# Altium project Hydra A1 UCLO 35131D.PrjPCB (part 1 of 14)
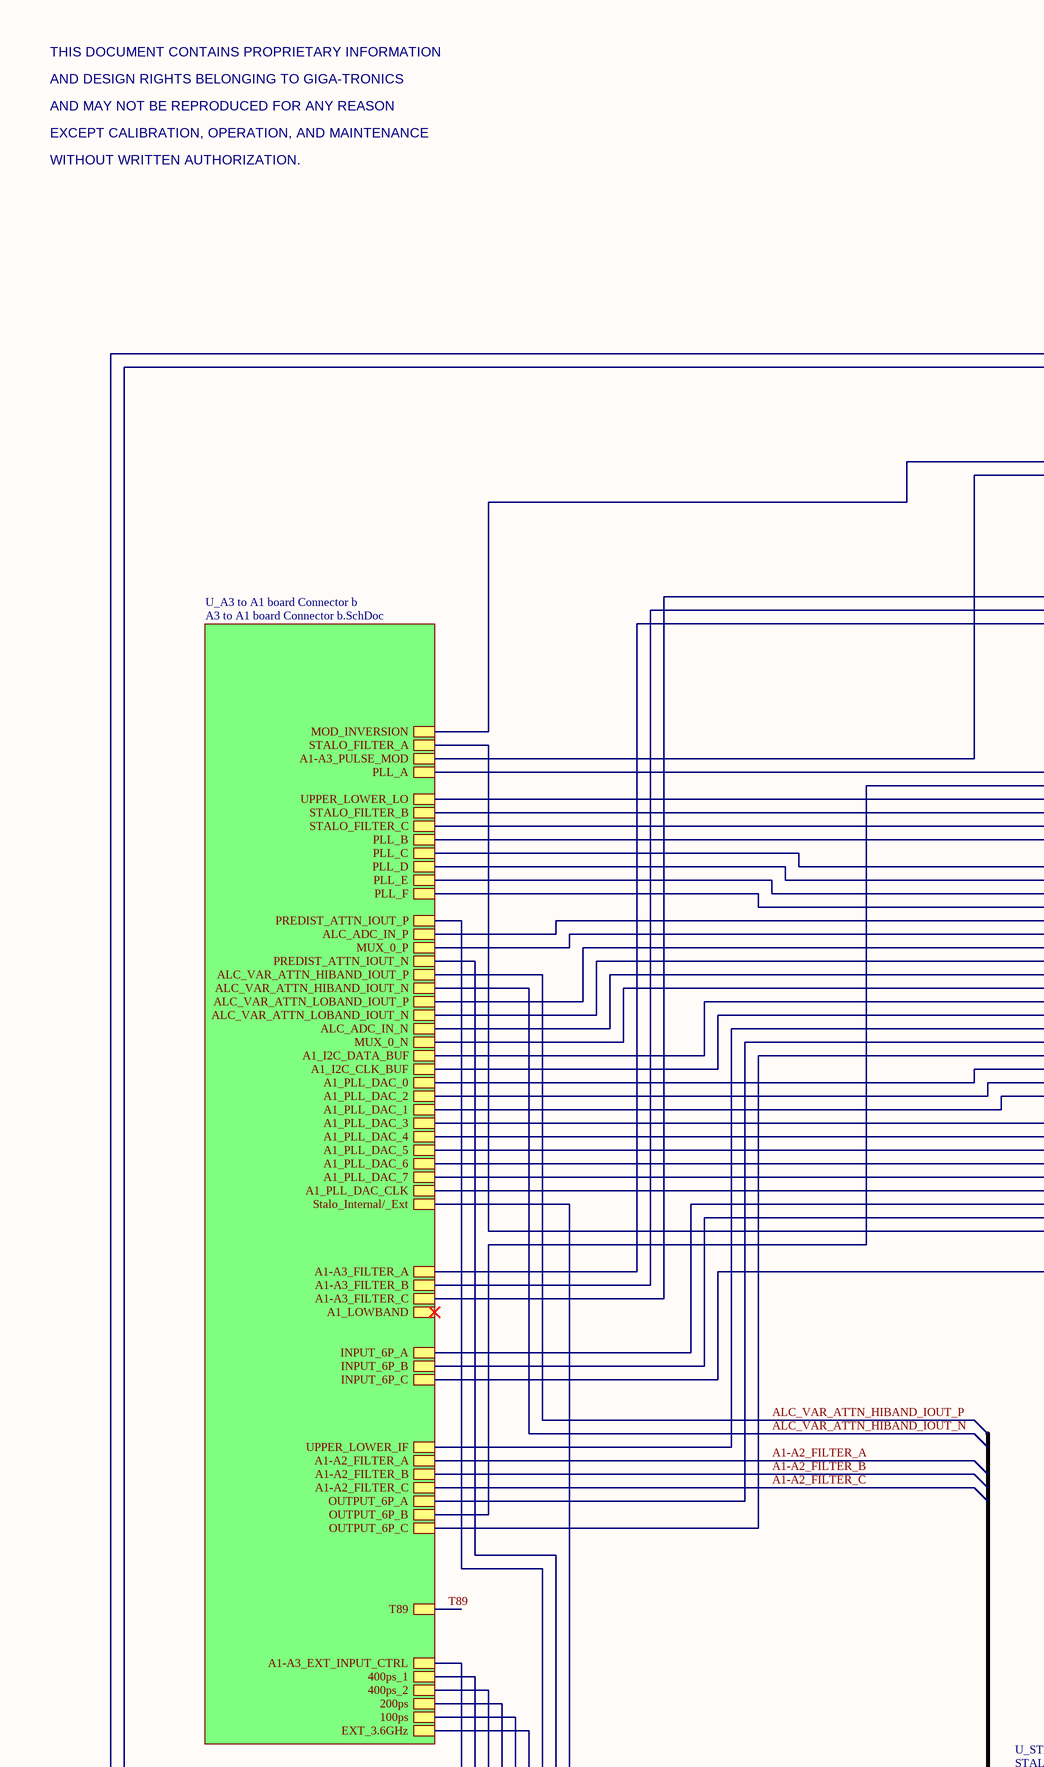
[diagram p0: Sheet1_35131-35133.SchDoc, top left]
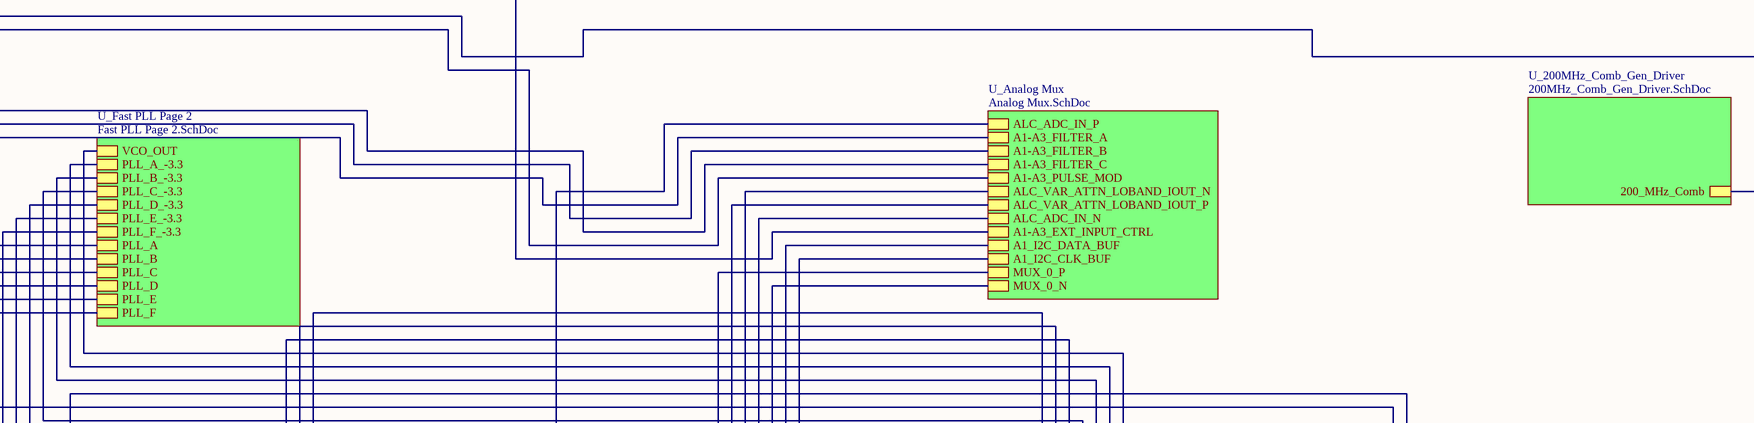
[diagram p1: Sheet1_35131-35133.SchDoc, top middle]
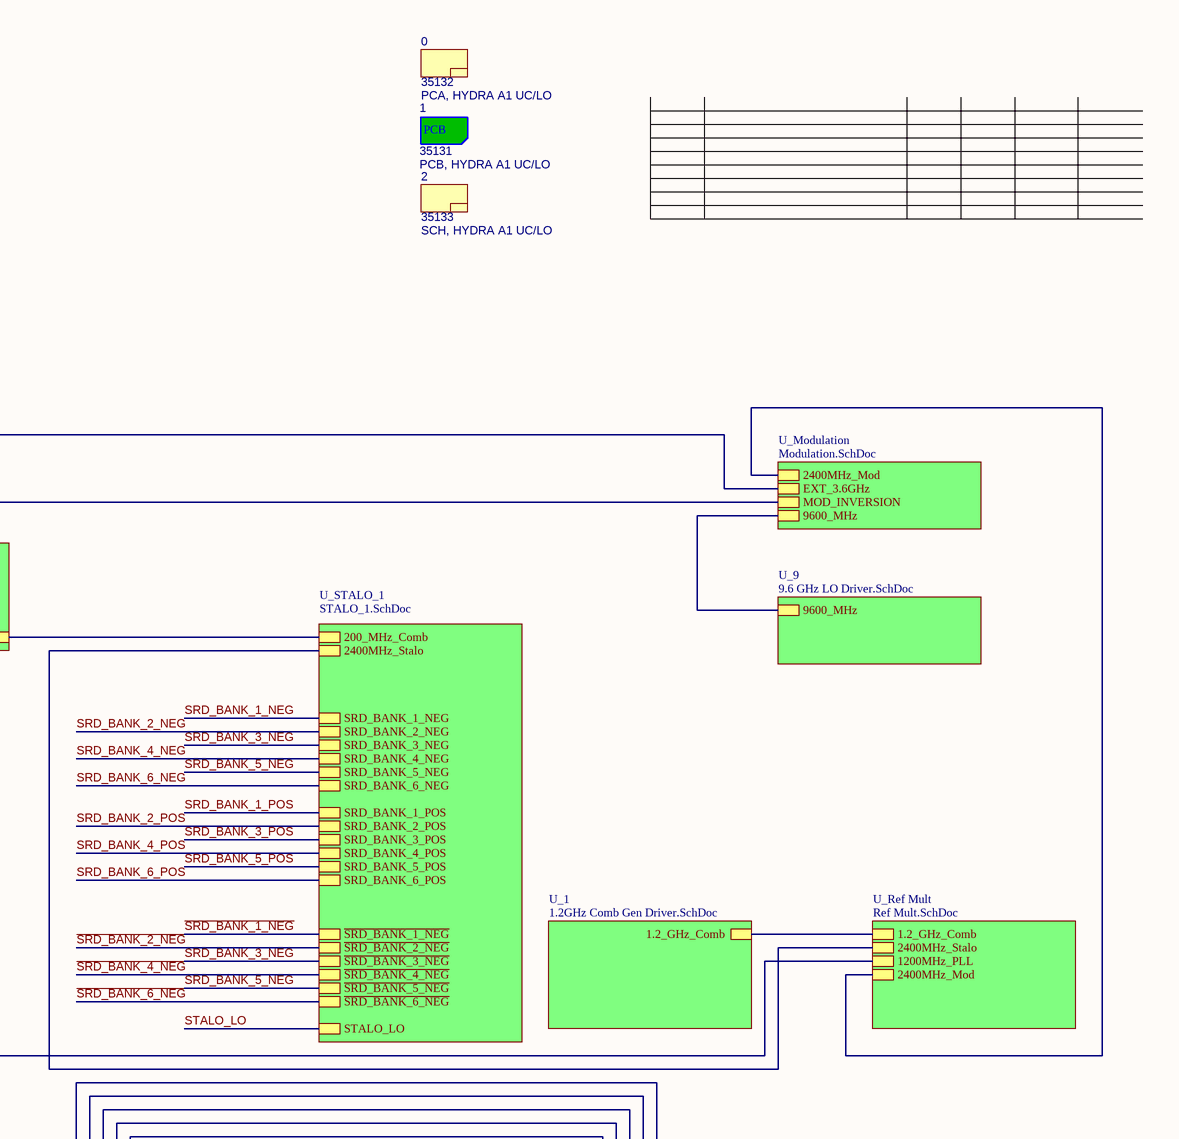
[diagram p2: Sheet1_35131-35133.SchDoc, top right]
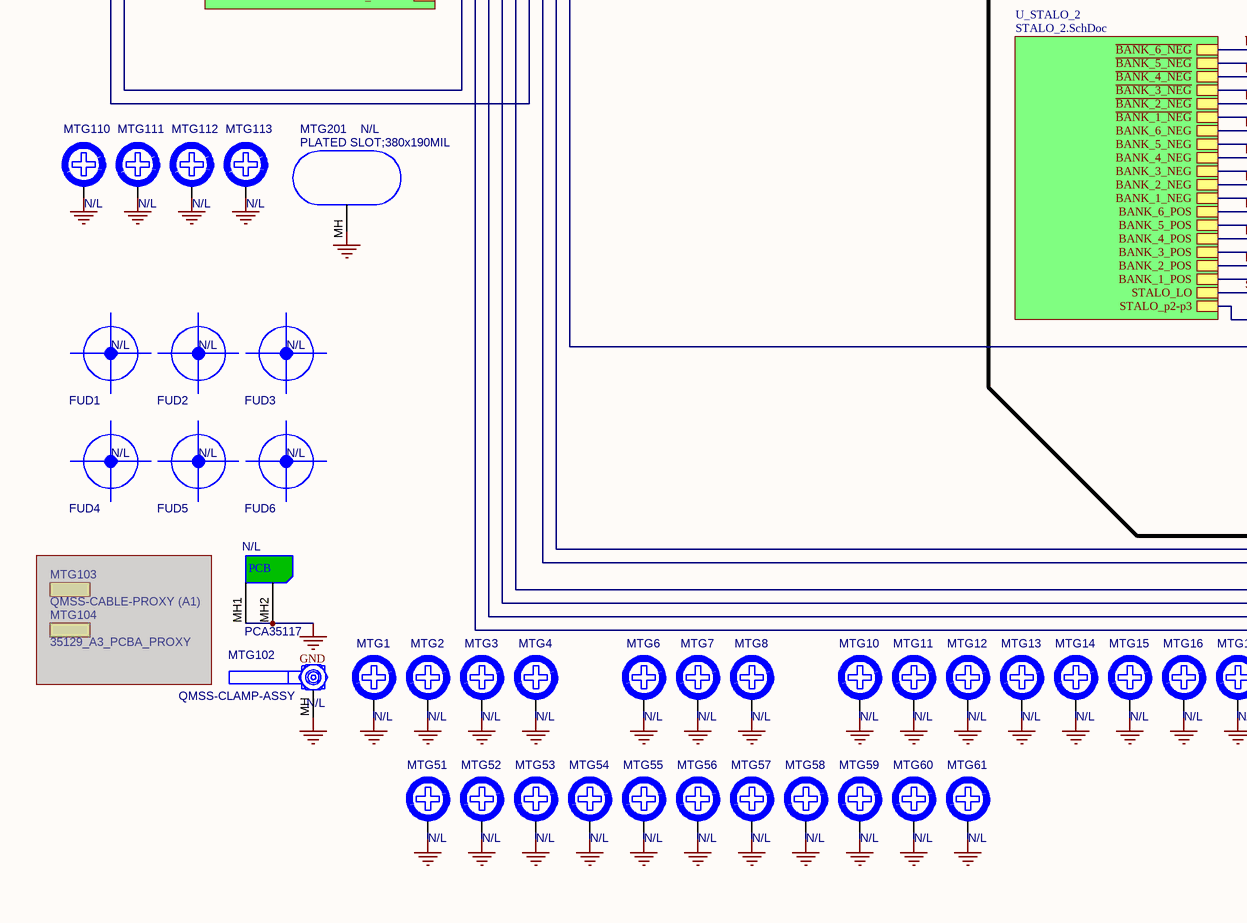
[diagram p3: Sheet1_35131-35133.SchDoc, bottom left]
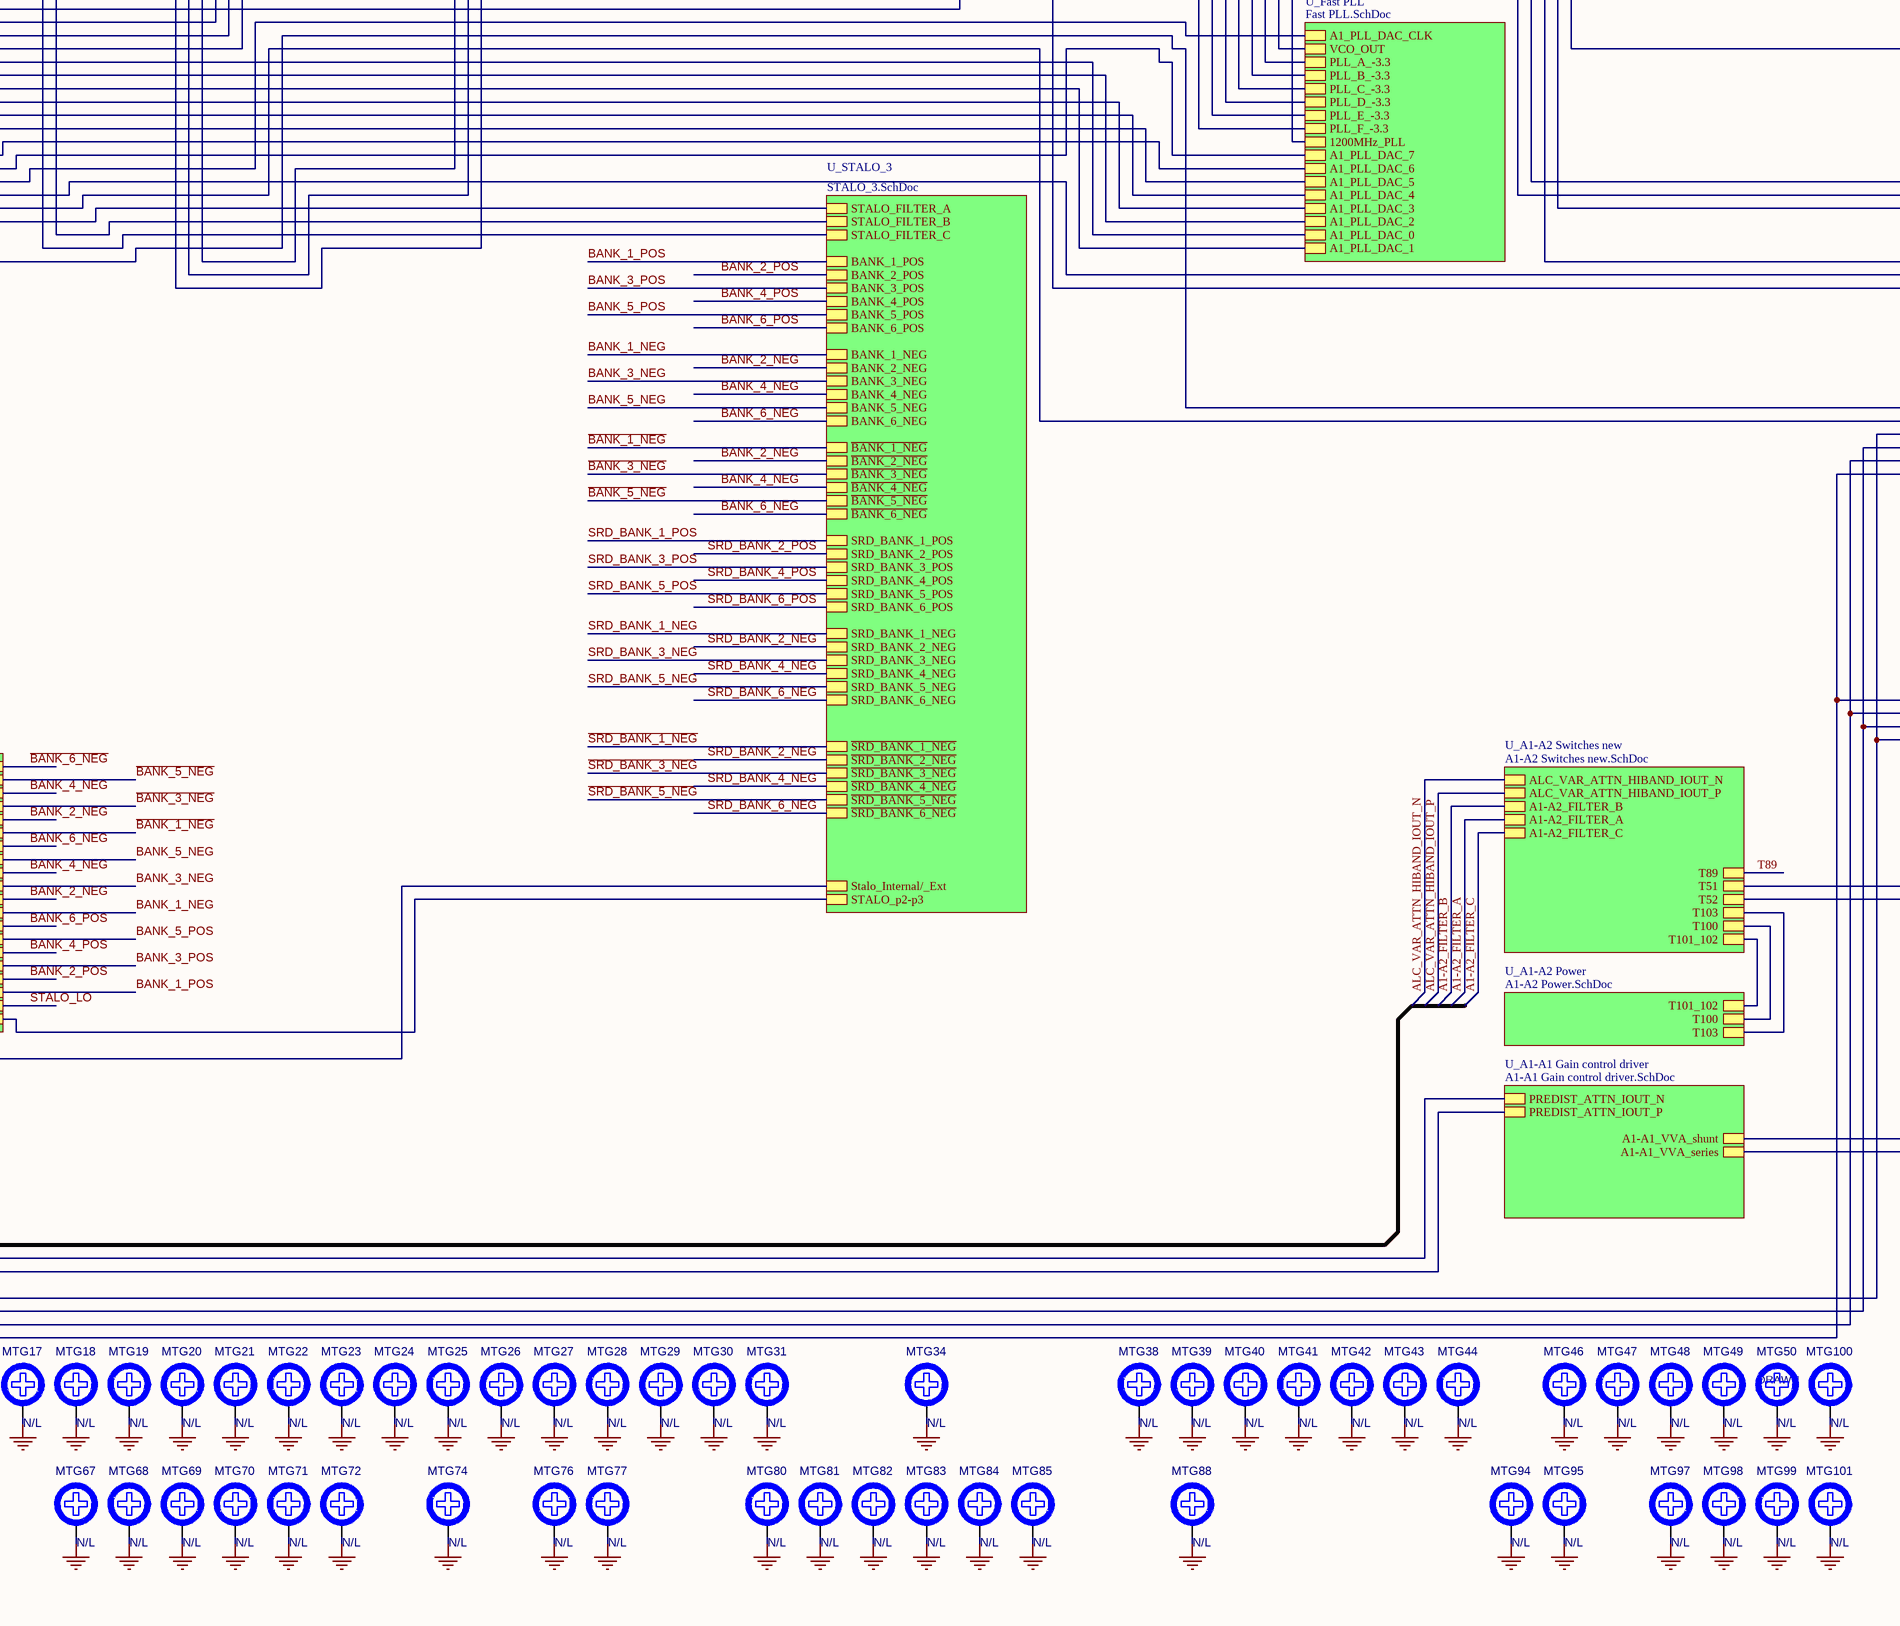
[diagram p4: Sheet1_35131-35133.SchDoc, bottom middle]
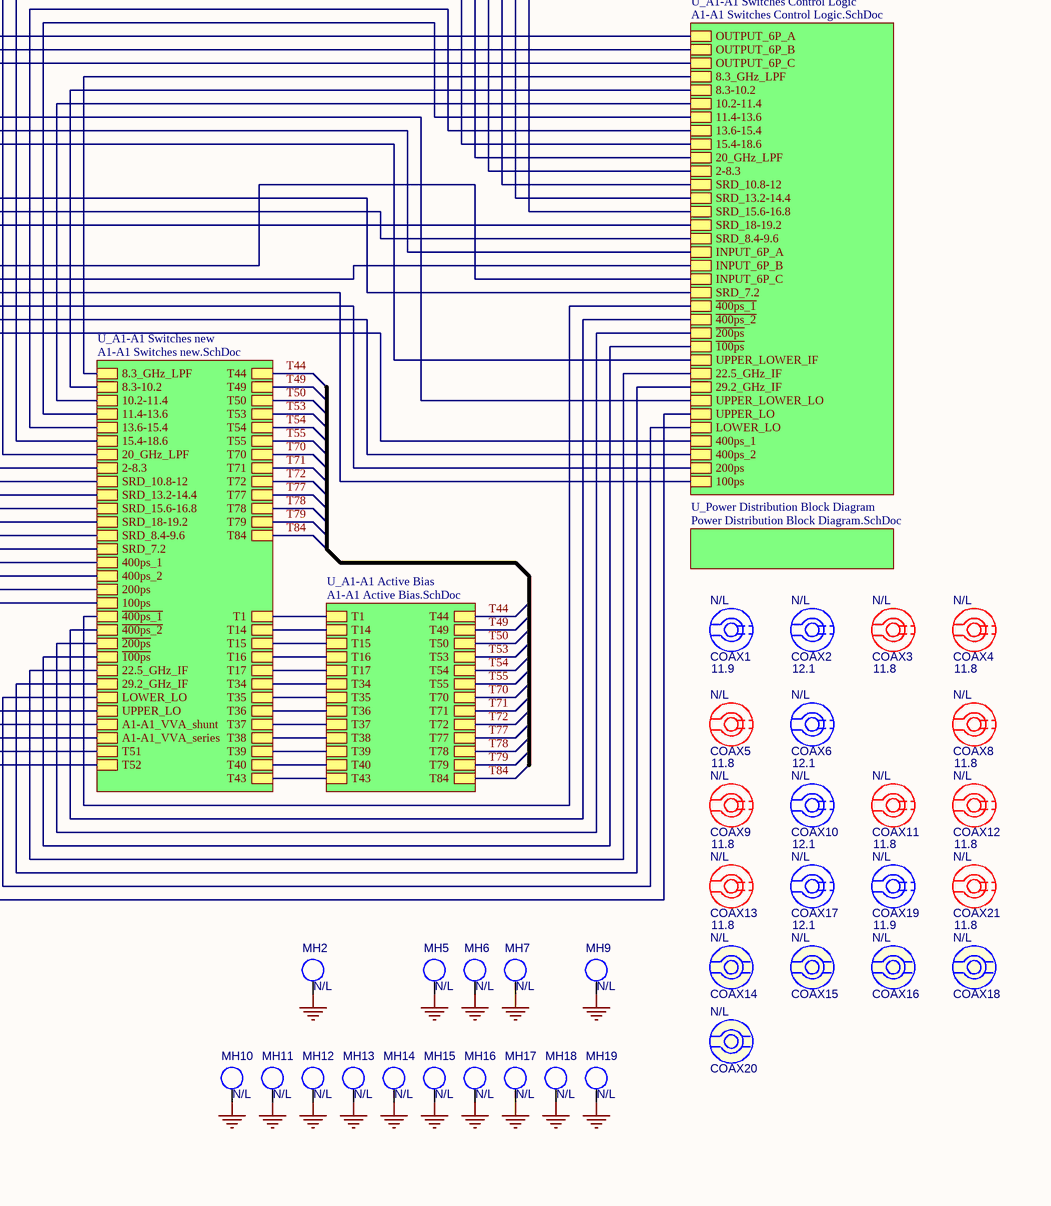
[diagram p5: Sheet1_35131-35133.SchDoc, bottom right]
1PCA_DRW: NM; 1SCH_APPD: CL; 1SCH_DATE: 01-25-13; 1SCH_DESC: INITIAL RELEASE; 1SCH_DRW: CL; 1SCH_ECO: 011078; 1SCH_REV: A; 2PCA_DRW: TM; 2SCH_APPD: CL; 2SCH_DATE: 09-13-13; 2SCH_DESC: COMPLETE RE-DESIGN; 2SCH_DRW: CL; 2SCH_ECO: 011391; 2SCH_REV: B; 3PCA_DRW: CL; 3SCH_APPD: CL; 3SCH_DATE: 09-20-14; 3SCH_DESC: PARTIAL RE-DESIGN; 3SCH_DRW: CL; 3SCH_ECO: 011701; 3SCH_REV: B1; 4PCA_DRW: CL; 4SCH_APPD: CL; 4SCH_DATE: 12-12-14; 4SCH_DESC: SEVERAL MODIFICATIONS; 4SCH_DRW: CL; 4SCH_ECO: 011759; 4SCH_REV: C; 5PCA_DRW: CL; 5SCH_APPD: CL; 5SCH_DATE: 12-19-14; 5SCH_DESC: SEVERAL MODIFICATIONS; 5SCH_DRW: CL; 5SCH_ECO: 011771; 5SCH_REV: D; 6PCA_DRW: MH; 6SCH_APPD: CL; 6SCH_DATE: 06-25-15; 6SCH_DESC: REWORK #2 A1-A6 HOLE TO #4; 6SCH_DRW: MH; 6SCH_ECO: 011876; 6SCH_REV: E; 7PCA_DRW: MH; 7SCH_APPD: CL; 7SCH_DATE: 08-20-15; 7SCH_DESC: CHANGES TO MEET ELEC. SPEC.; 7SCH_DRW: CL; 7SCH_ECO: 011955; 7SCH_REV: F; 8PCA_DRW: MH; 8SCH_APPD: CL; 8SCH_DATE: 01-26-16; 8SCH_DESC: HYDRA A1: 35131F, 35312J; 8SCH_DRW: CL; 8SCH_ECO: 012042; 8SCH_REV: J; 9PCA_DRW: MH; 9SCH_APPD: CL; 9SCH_DATE: 03-31-16; 9SCH_DESC: STALO MODS; 9SCH_DRW: CL; 9SCH_ECO: 012261; 9SCH_REV: K; 10PCA_DRW: MH; 10SCH_APPD: CL; 10SCH_DATE: 11-16-16; 10SCH_DESC: A11 BIAS CHANGE; 10SCH_DRW: MH; 10SCH_ECO: 012390; 10SCH_REV: L; 11PCA_DRW: MH; 11SCH_APPD: CL; 11SCH_DATE: 12-14-16; 11SCH_DESC: CHANGE AT16 TO 3DB; 11SCH_DRW: CL; 11SCH_ECO: 012405; 11SCH_REV: M; 12PCA_DRW: MH; 12SCH_APPD: CL; 12SCH_DATE: 12-16-16; 12SCH_DESC: A1 PERM CHANGE; 12SCH_DRW: CL; 12SCH_ECO: 012269; 12SCH_REV: N; ASSEMBLY_TITLE: CCA, HYDRA A1 UCLO; CAGE_CODE: 58900; CONTRACT_NUMBER: -; PCA_DWG_NO: T-35132; PCA_ED: 1; PCA_REV: N; PCA_TITLE: PCA, HYDRA A1 UC/LO; PCB_2_DEC_TOL: +/-.03; PCB_3_DEC_TOL: +/-.010; PCB_ANG_TOL: +/-1/2; PCB_DWG_NO: T-35131; PCB_ED: 1; PCB_PART_NUMBER: T-35131; PCB_REV: G; PCB_SCALE: NOT TO SCALE; PCB_TITLE: PCB, HYDRA A1 UC/LO; ProjectRevision: E; SCH_DATE: 01-26-16; SCH_DWG_NO: T-35133; SCH_ED: 1; SCH_REV: N; SCH_TITLE: SCH, HYDRA A1 UC/LO
20 sheets, 2898 parts. Net scope: hierarchical (ports join the sheet entries above them; power ports are global).
Board file: Hydra A1 UCLO 35131D.PcbDoc
Sheets:
  Sheet1_35131-35133.SchDoc
    U_A1-A2 Switches new = A1-A2 Switches new.SchDoc
    U_1 = 1.2GHz Comb Gen Driver.SchDoc
    U_A1-A1 Active Bias = A1-A1 Active Bias.SchDoc
    U_A1-A1 Gain control driver = A1-A1 Gain control driver.SchDoc
    U_Fast PLL Page 2 = Fast PLL Page 2.SchDoc
    U_Fast PLL = Fast PLL.SchDoc
    U_A1-A1 Switches Control Logic = A1-A1 Switches Control Logic.SchDoc
    U_Analog Mux = Analog Mux.SchDoc
    U_A1-A1 Switches new = A1-A1 Switches new.SchDoc
    U_200MHz_Comb_Gen_Driver = 200MHz_Comb_Gen_Driver.SchDoc
    U_Power Distribution Block Diagram = Power Distribution Block Diagram.SchDoc
    U_A1-A2 Power = A1-A2 Power.SchDoc
    U_Ref Mult = Ref Mult.SchDoc
    U_A3 to A1 board Connector b = A3 to A1 board Connector b.SchDoc
    U_STALO_2 = STALO_2.SchDoc
    U_STALO_1 = STALO_1.SchDoc
    U_STALO_3 = STALO_3.SchDoc
    U_9 = 9.6 GHz LO Driver.SchDoc
    U_Modulation = Modulation.SchDoc

## Sheet Sheet1_35131-35133.SchDoc: Sheet1_35131-35133
size D; Date: 3/18/2014; CheckedBy: M. HOOPES; DrawnBy: C. LEWIS; Engineer: C. LEWIS; Address1: 4650 NORRIS CANYON RD.; Address2: SAN RAMON, CA 94583; DocumentNumber: 35133; Revision: D; SheetNumber: 1; SheetTotal: 20; PageSetup: Record=PageOptions|CenterHorizontal=True|CenterVertical=True|PrintScale=0.68|XCorrection=1.00|YCorrection=1.00|PrintKind=1|BorderSize=5000000|LeftOffset=0|BottomOffset=0|Orientation=2|PaperLength=1000|PaperWidth=1000|Scale=100|PaperSource=15|PrintQuality=600|MediaType=1|DitherType=10|PaperKind=11x17|PrintScaleMode=1; MfgEng: S. GARCIA; QA: G. GARRETTSON; DocumentName: Sheet1.SCHDOC; ModifiedDate: 2-12-13

### Parts
(Parts that share a designator on the sheet are numbered #1, #2 ... from top to bottom, then left to right.)
0  value PCA, HYDRA A1 UC/LO  (hidden comment: 35132)  (mechanical)
1  value PCB, HYDRA A1 UC/LO  (hidden comment: 35131)  (mechanical)
2  value SCH, HYDRA A1 UC/LO  (hidden comment: 35133)  (mechanical)
COAX1  NoLoad: N/L  [Coax_Bot-Mid4]  (hidden comment: Coax Bot-Mid4)
COAX2  NoLoad: N/L  [Coax_Bot-Mid4]  (hidden comment: Coax Bot-Mid4)
COAX3  NoLoad: N/L  [Coax_Top-Mid3]  (hidden comment: Coax Top-Mid3)
COAX4  NoLoad: N/L  [Coax_Top-Mid3]  (hidden comment: Coax Top-Mid3)
COAX5  NoLoad: N/L  [Coax_Top-Mid3]  (hidden comment: Coax Top-Mid3)
COAX6  NoLoad: N/L  [Coax_Bot-Mid4]  (hidden comment: Coax Bot-Mid4)
COAX8  NoLoad: N/L  [Coax_Top-Mid3]  (hidden comment: Coax Top-Mid3)
COAX9  NoLoad: N/L  [Coax_Top-Mid3]  (hidden comment: Coax Top-Mid3)
COAX10  NoLoad: N/L  [Coax_Bot-Mid4]  (hidden comment: Coax Bot-Mid4)
COAX11  NoLoad: N/L  [Coax_Top-Mid3]  (hidden comment: Coax Top-Mid3)
COAX12  NoLoad: N/L  [Coax_Top-Mid3]  (hidden comment: Coax Top-Mid3)
COAX13  NoLoad: N/L  [Coax_Top-Mid3]  (hidden comment: Coax Top-Mid3)
COAX14  NoLoad: N/L  [Coax_Top-Bot]  (hidden comment: Coax Top-Bot)
COAX15  NoLoad: N/L  [Coax_Top-Bot]  (hidden comment: Coax Top-Bot)
COAX16  NoLoad: N/L  [Coax_Top-Bot]  (hidden comment: Coax Top-Bot)
COAX17  NoLoad: N/L  [Coax_Bot-Mid4]  (hidden comment: Coax Bot-Mid4)
COAX18  NoLoad: N/L  [Coax_Top-Bot]  (hidden comment: Coax Top-Bot)
COAX19  NoLoad: N/L  [Coax_Bot-Mid4]  (hidden comment: Coax Bot-Mid4)
COAX20  NoLoad: N/L  [Coax_Top-Bot]  (hidden comment: Coax Top-Bot)
COAX21  NoLoad: N/L  [Coax_Top-Mid3]  (hidden comment: Coax Top-Mid3)
FUD1  NoLoad: N/L  [FIDUCIAL_GLOBAL]  (hidden comment: FIDUCIAL_GLOBAL)
FUD2  NoLoad: N/L  [FIDUCIAL_GLOBAL]  (hidden comment: FIDUCIAL_GLOBAL)
FUD3  NoLoad: N/L  [FIDUCIAL_GLOBAL]  (hidden comment: FIDUCIAL_GLOBAL)
FUD4  NoLoad: N/L  [FIDUCIAL_GLOBAL]  (hidden comment: FIDUCIAL_GLOBAL)
FUD5  NoLoad: N/L  [FIDUCIAL_GLOBAL]  (hidden comment: FIDUCIAL_GLOBAL)
FUD6  NoLoad: N/L  [FIDUCIAL_GLOBAL]  (hidden comment: FIDUCIAL_GLOBAL)
MH2  N/L  [MHP-250X116]
MH5  N/L  [MHP-250X116]
MH6  N/L  [MHP-250X116]
MH7  N/L  [MHP-250X116]
MH9  N/L  [MHP-250X116]
MH10  N/L  [MHP-250X116]
MH11  N/L  [MHP-250X116]
MH12  N/L  [MHP-250X116]
MH13  N/L  [MHP-250X116]
MH14  N/L  [MHP-250X116]
MH15  N/L  [MHP-250X116]
MH16  N/L  [MHP-250X116]
MH17  N/L  [MHP-250X116]
MH18  N/L  [MHP-250X116]
MH19  N/L  [MHP-250X116]
MTG1  NoLoad: N/L  [MHP200X92]
MTG2  NoLoad: N/L  [MHP200X92]
MTG3  NoLoad: N/L  [MHP200X92]
MTG4  NoLoad: N/L  [MHP200X92]
MTG6  NoLoad: N/L  [MHP200X92]
MTG7  NoLoad: N/L  [MHP200X92]
MTG8  NoLoad: N/L  [MHP200X92]
MTG10  NoLoad: N/L  [MHP200X92]
MTG11  NoLoad: N/L  [MHP200X92]
MTG12  NoLoad: N/L  [MHP200X92]
MTG13  NoLoad: N/L  [MHP200X92]
MTG14  NoLoad: N/L  [MHP200X92]
MTG15  NoLoad: N/L  [MHP200X92]
MTG16  NoLoad: N/L  [MHP200X92]
MTG17  NoLoad: N/L  [MHP200X92]
MTG18  NoLoad: N/L  [MHP200X92]
MTG19  NoLoad: N/L  [MHP200X92]
MTG20  NoLoad: N/L  [MHP200X92]
MTG21  NoLoad: N/L  [MHP200X92]
MTG22  NoLoad: N/L  [MHP200X92]
MTG23  NoLoad: N/L  [MHP200X92]
MTG24  NoLoad: N/L  [MHP200X92]
MTG25  NoLoad: N/L  [MHP200X92]
MTG26  NoLoad: N/L  [MHP200X92]
MTG27  NoLoad: N/L  [MHP200X92]
MTG28  NoLoad: N/L  [MHP200X92]
MTG29  NoLoad: N/L  [MHP200X92]
MTG30  NoLoad: N/L  [MHP200X92]
MTG31  NoLoad: N/L  [MHP200X92]
MTG34  NoLoad: N/L  [MHP200X92]
MTG38  NoLoad: N/L  [MHP200X92]
MTG39  NoLoad: N/L  [MHP200X92]
MTG40  NoLoad: N/L  [MHP200X92]
MTG41  NoLoad: N/L  [MHP200X92]
MTG42  NoLoad: N/L  [MHP200X92]
MTG43  NoLoad: N/L  [MHP200X92]
MTG44  NoLoad: N/L  [MHP200X92]
MTG46  NoLoad: N/L  [MHP200X92]
MTG47  NoLoad: N/L  [MHP200X92]
MTG48  NoLoad: N/L  [MHP200X92]
MTG49  NoLoad: N/L  [MHP200X92]
MTG50  NoLoad: N/L  [MHP200X92]
MTG51  NoLoad: N/L  [MHP200X92]
MTG52  NoLoad: N/L  [MHP200X92]
MTG53  NoLoad: N/L  [MHP200X92]
MTG54  NoLoad: N/L  [MHP200X92]
MTG55  NoLoad: N/L  [MHP200X92]
MTG56  NoLoad: N/L  [MHP200X92]
MTG57  NoLoad: N/L  [MHP200X92]
MTG58  NoLoad: N/L  [MHP200X92]
MTG59  NoLoad: N/L  [MHP200X92]
MTG60  NoLoad: N/L  [MHP200X92]
MTG61  NoLoad: N/L  [MHP200X92]
MTG67  NoLoad: N/L  [MHP200X92]
MTG68  NoLoad: N/L  [MHP200X92]
MTG69  NoLoad: N/L  [MHP200X92]
MTG70  NoLoad: N/L  [MHP200X92]
MTG71  NoLoad: N/L  [MHP200X92]
MTG72  NoLoad: N/L  [MHP200X92]
MTG74  NoLoad: N/L  [MHP200X92]
MTG76  NoLoad: N/L  [MHP200X92]
MTG77  NoLoad: N/L  [MHP200X92]
MTG80  NoLoad: N/L  [MHP200X92]
MTG81  NoLoad: N/L  [MHP200X92]
MTG82  NoLoad: N/L  [MHP200X92]
MTG83  NoLoad: N/L  [MHP200X92]
MTG84  NoLoad: N/L  [MHP200X92]
MTG85  NoLoad: N/L  [MHP200X92]
MTG88  NoLoad: N/L  [MHP200X92]
MTG94  NoLoad: N/L  [MHP200X92]
MTG95  NoLoad: N/L  [MHP200X92]
MTG97  NoLoad: N/L  [MHP200X92]
MTG98  NoLoad: N/L  [MHP200X92]
MTG99  NoLoad: N/L  [MHP200X92]
MTG100  NoLoad: N/L  [MHP200X92]
MTG101  NoLoad: N/L  [MHP200X92]
MTG102  QMSS-CLAMP-ASSY  NoLoad: N/L  [QMSS-CLAMP]
MTG103#1  QMSS-CABLE-PROXY (A1)  [QMSS-CABLE-PROXY (A1)]  (masked out: inside a compile mask, not in the netlist)
MTG104#1  35129_A3_PCBA_PROXY  [35129_A3_PCBA_PROXY]  (masked out: inside a compile mask, not in the netlist)
MTG110  NoLoad: N/L  [MHP150X67]
MTG111  NoLoad: N/L  [MHP150X67]
MTG112  NoLoad: N/L  [MHP150X67]
MTG113  NoLoad: N/L  [MHP150X67]
MTG201  PLATED SLOT;380x190MIL  NoLoad: N/L  [PLATED_SLOT-380x190MIL]
PCA35117  NoLoad: N/L  [35117]  (hidden comment: 35117)

### Sub-sheets
U_1 = 1.2GHz Comb Gen Driver.SchDoc: 1.2_GHz_Comb
U_9 = 9.6 GHz LO Driver.SchDoc: 9600_MHz
U_200MHz_Comb_Gen_Driver = 200MHz_Comb_Gen_Driver.SchDoc: 200_MHz_Comb
U_A1-A1 Active Bias = A1-A1 Active Bias.SchDoc: T1, T14, T15, T16, T17, T34, T35, T36, T37, T38, T39, T40, T43, T44, T49, T50, T53, T54, T55, T70, T71, T72, T77, T78, T79, T84
U_A1-A1 Gain control driver = A1-A1 Gain control driver.SchDoc: PREDIST_ATTN_IOUT_P, PREDIST_ATTN_IOUT_N, A1-A1_VVA_shunt, A1-A1_VVA_series
U_A1-A1 Switches Control Logic = A1-A1 Switches Control Logic.SchDoc: OUTPUT_6P_A, OUTPUT_6P_B, OUTPUT_6P_C, 8.3_GHz_LPF, 8.3-10.2, 10.2-11.4, 11.4-13.6, 13.6-15.4, 15.4-18.6, 20_GHz_LPF, 2-8.3, SRD_10.8-12, SRD_13.2-14.4, SRD_15.6-16.8, SRD_18-19.2, SRD_8.4-9.6, INPUT_6P_A, INPUT_6P_B, INPUT_6P_C, SRD_7.2, ~{400ps_1}, ~{400ps_2}, ~{200ps}, ~{100ps}, UPPER_LOWER_IF, 22.5_GHz_IF, 29.2_GHz_IF, UPPER_LOWER_LO, UPPER_LO, LOWER_LO, 400ps_1, 400ps_2, 200ps, 100ps
U_A1-A1 Switches new = A1-A1 Switches new.SchDoc: 8.3_GHz_LPF, 8.3-10.2, 10.2-11.4, 11.4-13.6, 13.6-15.4, 15.4-18.6, 20_GHz_LPF, 2-8.3, SRD_10.8-12, SRD_13.2-14.4, SRD_15.6-16.8, SRD_18-19.2, SRD_8.4-9.6, SRD_7.2, 400ps_1, 400ps_2, 200ps, 100ps, ~{400ps_1}, ~{400ps_2}, ~{200ps}, ~{100ps}, 22.5_GHz_IF, 29.2_GHz_IF, LOWER_LO, UPPER_LO, T1, T14, T15, T16, T17, T34, T35, T36, T37, T38, T39, T40, T43, T44, T49, T50, T53, T54, T55, T70, T71, T72, T77, T78, T79, T84, A1-A1_VVA_shunt, A1-A1_VVA_series, T52, T51
U_A1-A2 Power = A1-A2 Power.SchDoc: T101_102, T100, T103
U_A1-A2 Switches new = A1-A2 Switches new.SchDoc: ALC_VAR_ATTN_HIBAND_IOUT_N, ALC_VAR_ATTN_HIBAND_IOUT_P, A1-A2_FILTER_B, A1-A2_FILTER_A, A1-A2_FILTER_C, T101_102, T100, T103, T52, T51, T89
U_A3 to A1 board Connector b = A3 to A1 board Connector b.SchDoc: MOD_INVERSION, STALO_FILTER_A, A1-A3_PULSE_MOD, PLL_A, UPPER_LOWER_LO, STALO_FILTER_B, STALO_FILTER_C, PLL_B, PLL_C, PLL_D, PLL_E, PLL_F, PREDIST_ATTN_IOUT_P, ALC_ADC_IN_P, MUX_0_P, PREDIST_ATTN_IOUT_N, ALC_VAR_ATTN_HIBAND_IOUT_P, ALC_VAR_ATTN_HIBAND_IOUT_N, ALC_VAR_ATTN_LOBAND_IOUT_P, ALC_VAR_ATTN_LOBAND_IOUT_N, ALC_ADC_IN_N, MUX_0_N, A1_I2C_DATA_BUF, A1_I2C_CLK_BUF, A1_PLL_DAC_0, A1_PLL_DAC_2, A1_PLL_DAC_1, A1_PLL_DAC_3, A1_PLL_DAC_4, A1_PLL_DAC_5, A1_PLL_DAC_6, A1_PLL_DAC_7, A1_PLL_DAC_CLK, A1-A3_FILTER_A, A1-A3_FILTER_B, A1-A3_FILTER_C, A1_LOWBAND, INPUT_6P_A, INPUT_6P_B, INPUT_6P_C, UPPER_LOWER_IF, A1-A2_FILTER_A, A1-A2_FILTER_B, A1-A2_FILTER_C, OUTPUT_6P_A, OUTPUT_6P_B, OUTPUT_6P_C, A1-A3_EXT_INPUT_CTRL, 400ps_1, 400ps_2, 200ps, 100ps, EXT_3.6GHz, Stalo_Internal/_Ext, T89
U_Analog Mux = Analog Mux.SchDoc: ALC_ADC_IN_P, A1-A3_FILTER_A, A1-A3_FILTER_B, A1-A3_FILTER_C, A1-A3_PULSE_MOD, ALC_VAR_ATTN_LOBAND_IOUT_N, ALC_VAR_ATTN_LOBAND_IOUT_P, ALC_ADC_IN_N, A1-A3_EXT_INPUT_CTRL, A1_I2C_DATA_BUF, A1_I2C_CLK_BUF, MUX_0_P, MUX_0_N
U_Fast PLL = Fast PLL.SchDoc: A1_PLL_DAC_CLK, VCO_OUT, PLL_A_-3.3, PLL_B_-3.3, PLL_C_-3.3, PLL_D_-3.3, PLL_E_-3.3, PLL_F_-3.3, 1200MHz_PLL, A1_PLL_DAC_7, A1_PLL_DAC_6, A1_PLL_DAC_5, A1_PLL_DAC_4, A1_PLL_DAC_3, A1_PLL_DAC_2, A1_PLL_DAC_0, A1_PLL_DAC_1
U_Fast PLL Page 2 = Fast PLL Page 2.SchDoc: VCO_OUT, PLL_A_-3.3, PLL_B_-3.3, PLL_C_-3.3, PLL_D_-3.3, PLL_E_-3.3, PLL_F_-3.3, PLL_A, PLL_B, PLL_C, PLL_D, PLL_E, PLL_F
U_Modulation = Modulation.SchDoc: 2400MHz_Mod, EXT_3.6GHz, MOD_INVERSION, 9600_MHz
U_Power Distribution Block Diagram = Power Distribution Block Diagram.SchDoc: no entries
U_Ref Mult = Ref Mult.SchDoc: 1.2_GHz_Comb, 2400MHz_Stalo, 1200MHz_PLL, 2400MHz_Mod
U_STALO_1 = STALO_1.SchDoc: 2400MHz_Stalo, 200_MHz_Comb, SRD_BANK_1_NEG, SRD_BANK_2_NEG, ~{SRD_BANK_2_NEG}, ~{SRD_BANK_3_NEG}, SRD_BANK_3_NEG, SRD_BANK_4_NEG, ~{SRD_BANK_4_NEG}, SRD_BANK_5_NEG, ~{SRD_BANK_5_NEG}, SRD_BANK_6_NEG, ~{SRD_BANK_6_NEG}, STALO_LO, SRD_BANK_1_POS, SRD_BANK_2_POS, SRD_BANK_3_POS, SRD_BANK_4_POS, SRD_BANK_5_POS, SRD_BANK_6_POS, ~{SRD_BANK_1_NEG}
U_STALO_2 = STALO_2.SchDoc: STALO_LO, STALO_p2-p3, BANK_1_POS, BANK_2_POS, BANK_3_POS, BANK_4_POS, BANK_5_POS, BANK_6_POS, BANK_1_NEG, BANK_2_NEG, BANK_3_NEG, BANK_4_NEG, BANK_5_NEG, BANK_6_NEG, ~{BANK_1_NEG}, ~{BANK_2_NEG}, ~{BANK_3_NEG}, ~{BANK_4_NEG}, ~{BANK_5_NEG}, ~{BANK_6_NEG}
U_STALO_3 = STALO_3.SchDoc: STALO_FILTER_A, STALO_FILTER_B, STALO_FILTER_C, Stalo_Internal/_Ext, STALO_p2-p3, BANK_1_POS, BANK_2_POS, BANK_3_POS, BANK_4_POS, BANK_5_POS, BANK_6_POS, BANK_1_NEG, BANK_2_NEG, BANK_3_NEG, BANK_4_NEG, BANK_5_NEG, BANK_6_NEG, ~{BANK_1_NEG}, ~{BANK_2_NEG}, ~{BANK_3_NEG}, ~{BANK_4_NEG}, ~{BANK_5_NEG}, ~{BANK_6_NEG}, SRD_BANK_1_POS, SRD_BANK_2_POS, SRD_BANK_3_POS, SRD_BANK_4_POS, SRD_BANK_5_POS, SRD_BANK_6_POS, SRD_BANK_1_NEG, SRD_BANK_2_NEG, SRD_BANK_3_NEG, SRD_BANK_4_NEG, SRD_BANK_5_NEG, SRD_BANK_6_NEG, ~{SRD_BANK_1_NEG}, ~{SRD_BANK_2_NEG}, ~{SRD_BANK_3_NEG}, ~{SRD_BANK_4_NEG}, ~{SRD_BANK_5_NEG}, ~{SRD_BANK_6_NEG}

### Nets
GND: MH2.MH MH5.MH MH6.MH MH7.MH MH9.MH MH10.MH MH11.MH MH12.MH MH13.MH MH14.MH MH15.MH MH16.MH MH17.MH MH18.MH MH19.MH MTG1.MH MTG2.MH MTG3.MH MTG4.MH MTG6.MH MTG7.MH MTG8.MH MTG10.MH MTG11.MH MTG12.MH MTG13.MH MTG14.MH MTG15.MH MTG16.MH MTG17.MH MTG18.MH MTG19.MH MTG20.MH MTG21.MH MTG22.MH MTG23.MH MTG24.MH MTG25.MH MTG26.MH MTG27.MH MTG28.MH MTG29.MH MTG30.MH MTG31.MH MTG34.MH MTG38.MH MTG39.MH MTG40.MH MTG41.MH MTG42.MH MTG43.MH MTG44.MH MTG46.MH MTG47.MH MTG48.MH MTG49.MH MTG50.MH MTG51.MH MTG52.MH MTG53.MH MTG54.MH MTG55.MH MTG56.MH MTG57.MH MTG58.MH MTG59.MH MTG60.MH MTG61.MH MTG67.MH MTG68.MH MTG69.MH MTG70.MH MTG71.MH MTG72.MH MTG74.MH MTG76.MH MTG77.MH MTG80.MH MTG81.MH MTG82.MH MTG83.MH MTG84.MH MTG85.MH MTG88.MH MTG94.MH MTG95.MH MTG97.MH MTG98.MH MTG99.MH MTG100.MH MTG101.MH MTG102.MH(KFH-440-12) MTG110.MH MTG111.MH MTG112.MH MTG113.MH MTG201.MH PCA35117.MH1 PCA35117.MH2
~{100ps}: sheet U_A1-A1 Switches Control Logic/~{100ps}, sheet U_A1-A1 Switches new/~{100ps}
2-8.3: sheet U_A1-A1 Switches Control Logic/2-8.3, sheet U_A1-A1 Switches new/2-8.3
~{200ps}: sheet U_A1-A1 Switches Control Logic/~{200ps}, sheet U_A1-A1 Switches new/~{200ps}
~{400ps_1}: sheet U_A1-A1 Switches Control Logic/~{400ps_1}, sheet U_A1-A1 Switches new/~{400ps_1}
~{400ps_2}: sheet U_A1-A1 Switches Control Logic/~{400ps_2}, sheet U_A1-A1 Switches new/~{400ps_2}
8.3-10.2: sheet U_A1-A1 Switches Control Logic/8.3-10.2, sheet U_A1-A1 Switches new/8.3-10.2
8.3_GHz_LPF: sheet U_A1-A1 Switches Control Logic/8.3_GHz_LPF, sheet U_A1-A1 Switches new/8.3_GHz_LPF
10.2-11.4: sheet U_A1-A1 Switches Control Logic/10.2-11.4, sheet U_A1-A1 Switches new/10.2-11.4
11.4-13.6: sheet U_A1-A1 Switches Control Logic/11.4-13.6, sheet U_A1-A1 Switches new/11.4-13.6
13.6-15.4: sheet U_A1-A1 Switches Control Logic/13.6-15.4, sheet U_A1-A1 Switches new/13.6-15.4
15.4-18.6: sheet U_A1-A1 Switches Control Logic/15.4-18.6, sheet U_A1-A1 Switches new/15.4-18.6
20_GHz_LPF: sheet U_A1-A1 Switches Control Logic/20_GHz_LPF, sheet U_A1-A1 Switches new/20_GHz_LPF
22.5_GHz_IF: sheet U_A1-A1 Switches Control Logic/22.5_GHz_IF, sheet U_A1-A1 Switches new/22.5_GHz_IF
29.2_GHz_IF: sheet U_A1-A1 Switches Control Logic/29.2_GHz_IF, sheet U_A1-A1 Switches new/29.2_GHz_IF
400ps_2: sheet U_A1-A1 Switches Control Logic/400ps_2, sheet U_A1-A1 Switches new/400ps_2, sheet U_A3 to A1 board Connector b/400ps_2
2400MHz_Mod: sheet U_Ref Mult/2400MHz_Mod, sheet U_Modulation/2400MHz_Mod
9600_MHz: sheet U_9/9600_MHz, sheet U_Modulation/9600_MHz
A1-A2_FILTER_A: sheet U_A1-A2 Switches new/A1-A2_FILTER_A, sheet U_A3 to A1 board Connector b/A1-A2_FILTER_A
A1-A2_FILTER_B: sheet U_A1-A2 Switches new/A1-A2_FILTER_B, sheet U_A3 to A1 board Connector b/A1-A2_FILTER_B
A1-A2_FILTER_C: sheet U_A1-A2 Switches new/A1-A2_FILTER_C, sheet U_A3 to A1 board Connector b/A1-A2_FILTER_C
A1_I2C_CLK_BUF: sheet U_Analog Mux/A1_I2C_CLK_BUF, sheet U_A3 to A1 board Connector b/A1_I2C_CLK_BUF
A1_I2C_DATA_BUF: sheet U_Analog Mux/A1_I2C_DATA_BUF, sheet U_A3 to A1 board Connector b/A1_I2C_DATA_BUF
A1_PLL_DAC_CLK: sheet U_Fast PLL/A1_PLL_DAC_CLK, sheet U_A3 to A1 board Connector b/A1_PLL_DAC_CLK
ALC_ADC_IN_N: sheet U_Analog Mux/ALC_ADC_IN_N, sheet U_A3 to A1 board Connector b/ALC_ADC_IN_N
ALC_ADC_IN_P: sheet U_Analog Mux/ALC_ADC_IN_P, sheet U_A3 to A1 board Connector b/ALC_ADC_IN_P
ALC_VAR_ATTN_HIBAND_IOUT_N: sheet U_A1-A2 Switches new/ALC_VAR_ATTN_HIBAND_IOUT_N, sheet U_A3 to A1 board Connector b/ALC_VAR_ATTN_HIBAND_IOUT_N
ALC_VAR_ATTN_HIBAND_IOUT_P: sheet U_A1-A2 Switches new/ALC_VAR_ATTN_HIBAND_IOUT_P, sheet U_A3 to A1 board Connector b/ALC_VAR_ATTN_HIBAND_IOUT_P
ALC_VAR_ATTN_LOBAND_IOUT_N: sheet U_Analog Mux/ALC_VAR_ATTN_LOBAND_IOUT_N, sheet U_A3 to A1 board Connector b/ALC_VAR_ATTN_LOBAND_IOUT_N
ALC_VAR_ATTN_LOBAND_IOUT_P: sheet U_Analog Mux/ALC_VAR_ATTN_LOBAND_IOUT_P, sheet U_A3 to A1 board Connector b/ALC_VAR_ATTN_LOBAND_IOUT_P
~{BANK_1_NEG}: sheet U_STALO_2/~{BANK_1_NEG}, sheet U_STALO_3/~{BANK_1_NEG}
~{BANK_2_NEG}: sheet U_STALO_2/~{BANK_2_NEG}, sheet U_STALO_3/~{BANK_2_NEG}
~{BANK_3_NEG}: sheet U_STALO_2/~{BANK_3_NEG}, sheet U_STALO_3/~{BANK_3_NEG}
~{BANK_4_NEG}: sheet U_STALO_2/~{BANK_4_NEG}, sheet U_STALO_3/~{BANK_4_NEG}
~{BANK_5_NEG}: sheet U_STALO_2/~{BANK_5_NEG}, sheet U_STALO_3/~{BANK_5_NEG}
~{BANK_6_NEG}: sheet U_STALO_2/~{BANK_6_NEG}, sheet U_STALO_3/~{BANK_6_NEG}
BANK_1_NEG: sheet U_STALO_2/BANK_1_NEG, sheet U_STALO_3/BANK_1_NEG
BANK_1_POS: sheet U_STALO_2/BANK_1_POS, sheet U_STALO_3/BANK_1_POS
BANK_2_NEG: sheet U_STALO_2/BANK_2_NEG, sheet U_STALO_3/BANK_2_NEG
BANK_2_POS: sheet U_STALO_2/BANK_2_POS, sheet U_STALO_3/BANK_2_POS
BANK_3_NEG: sheet U_STALO_2/BANK_3_NEG, sheet U_STALO_3/BANK_3_NEG
BANK_3_POS: sheet U_STALO_2/BANK_3_POS, sheet U_STALO_3/BANK_3_POS
BANK_4_NEG: sheet U_STALO_2/BANK_4_NEG, sheet U_STALO_3/BANK_4_NEG
BANK_4_POS: sheet U_STALO_2/BANK_4_POS, sheet U_STALO_3/BANK_4_POS
BANK_5_NEG: sheet U_STALO_2/BANK_5_NEG, sheet U_STALO_3/BANK_5_NEG
BANK_5_POS: sheet U_STALO_2/BANK_5_POS, sheet U_STALO_3/BANK_5_POS
BANK_6_NEG: sheet U_STALO_2/BANK_6_NEG, sheet U_STALO_3/BANK_6_NEG
BANK_6_POS: sheet U_STALO_2/BANK_6_POS, sheet U_STALO_3/BANK_6_POS
LOWER_LO: sheet U_A1-A1 Switches Control Logic/LOWER_LO, sheet U_A1-A1 Switches new/LOWER_LO
MUX_0_N: sheet U_Analog Mux/MUX_0_N, sheet U_A3 to A1 board Connector b/MUX_0_N
MUX_0_P: sheet U_Analog Mux/MUX_0_P, sheet U_A3 to A1 board Connector b/MUX_0_P
PREDIST_ATTN_IOUT_N: sheet U_A1-A1 Gain control driver/PREDIST_ATTN_IOUT_N, sheet U_A3 to A1 board Connector b/PREDIST_ATTN_IOUT_N
PREDIST_ATTN_IOUT_P: sheet U_A1-A1 Gain control driver/PREDIST_ATTN_IOUT_P, sheet U_A3 to A1 board Connector b/PREDIST_ATTN_IOUT_P
~{SRD_BANK_1_NEG}: sheet U_STALO_1/~{SRD_BANK_1_NEG}, sheet U_STALO_3/~{SRD_BANK_1_NEG}
~{SRD_BANK_2_NEG}: sheet U_STALO_1/~{SRD_BANK_2_NEG}, sheet U_STALO_3/~{SRD_BANK_2_NEG}
~{SRD_BANK_3_NEG}: sheet U_STALO_1/~{SRD_BANK_3_NEG}, sheet U_STALO_3/~{SRD_BANK_3_NEG}
~{SRD_BANK_4_NEG}: sheet U_STALO_1/~{SRD_BANK_4_NEG}, sheet U_STALO_3/~{SRD_BANK_4_NEG}
~{SRD_BANK_5_NEG}: sheet U_STALO_1/~{SRD_BANK_5_NEG}, sheet U_STALO_3/~{SRD_BANK_5_NEG}
~{SRD_BANK_6_NEG}: sheet U_STALO_1/~{SRD_BANK_6_NEG}, sheet U_STALO_3/~{SRD_BANK_6_NEG}
SRD_7.2: sheet U_A1-A1 Switches Control Logic/SRD_7.2, sheet U_A1-A1 Switches new/SRD_7.2
SRD_8.4-9.6: sheet U_A1-A1 Switches Control Logic/SRD_8.4-9.6, sheet U_A1-A1 Switches new/SRD_8.4-9.6
SRD_10.8-12: sheet U_A1-A1 Switches Control Logic/SRD_10.8-12, sheet U_A1-A1 Switches new/SRD_10.8-12
SRD_13.2-14.4: sheet U_A1-A1 Switches Control Logic/SRD_13.2-14.4, sheet U_A1-A1 Switches new/SRD_13.2-14.4
SRD_15.6-16.8: sheet U_A1-A1 Switches Control Logic/SRD_15.6-16.8, sheet U_A1-A1 Switches new/SRD_15.6-16.8
SRD_18-19.2: sheet U_A1-A1 Switches Control Logic/SRD_18-19.2, sheet U_A1-A1 Switches new/SRD_18-19.2
SRD_BANK_1_NEG: sheet U_STALO_1/SRD_BANK_1_NEG, sheet U_STALO_3/SRD_BANK_1_NEG
SRD_BANK_1_POS: sheet U_STALO_1/SRD_BANK_1_POS, sheet U_STALO_3/SRD_BANK_1_POS
SRD_BANK_2_NEG: sheet U_STALO_1/SRD_BANK_2_NEG, sheet U_STALO_3/SRD_BANK_2_NEG
SRD_BANK_2_POS: sheet U_STALO_1/SRD_BANK_2_POS, sheet U_STALO_3/SRD_BANK_2_POS
SRD_BANK_3_NEG: sheet U_STALO_1/SRD_BANK_3_NEG, sheet U_STALO_3/SRD_BANK_3_NEG
SRD_BANK_3_POS: sheet U_STALO_1/SRD_BANK_3_POS, sheet U_STALO_3/SRD_BANK_3_POS
SRD_BANK_4_NEG: sheet U_STALO_1/SRD_BANK_4_NEG, sheet U_STALO_3/SRD_BANK_4_NEG
SRD_BANK_4_POS: sheet U_STALO_1/SRD_BANK_4_POS, sheet U_STALO_3/SRD_BANK_4_POS
SRD_BANK_5_NEG: sheet U_STALO_1/SRD_BANK_5_NEG, sheet U_STALO_3/SRD_BANK_5_NEG
SRD_BANK_5_POS: sheet U_STALO_1/SRD_BANK_5_POS, sheet U_STALO_3/SRD_BANK_5_POS
SRD_BANK_6_NEG: sheet U_STALO_1/SRD_BANK_6_NEG, sheet U_STALO_3/SRD_BANK_6_NEG
SRD_BANK_6_POS: sheet U_STALO_1/SRD_BANK_6_POS, sheet U_STALO_3/SRD_BANK_6_POS
STALO_LO: sheet U_STALO_2/STALO_LO, sheet U_STALO_1/STALO_LO
T1: sheet U_A1-A1 Active Bias/T1, sheet U_A1-A1 Switches new/T1
T14: sheet U_A1-A1 Active Bias/T14, sheet U_A1-A1 Switches new/T14
T15: sheet U_A1-A1 Active Bias/T15, sheet U_A1-A1 Switches new/T15
T16: sheet U_A1-A1 Active Bias/T16, sheet U_A1-A1 Switches new/T16
T17: sheet U_A1-A1 Active Bias/T17, sheet U_A1-A1 Switches new/T17
T34: sheet U_A1-A1 Active Bias/T34, sheet U_A1-A1 Switches new/T34
T35: sheet U_A1-A1 Active Bias/T35, sheet U_A1-A1 Switches new/T35
T36: sheet U_A1-A1 Active Bias/T36, sheet U_A1-A1 Switches new/T36
T37: sheet U_A1-A1 Active Bias/T37, sheet U_A1-A1 Switches new/T37
T38: sheet U_A1-A1 Active Bias/T38, sheet U_A1-A1 Switches new/T38
T39: sheet U_A1-A1 Active Bias/T39, sheet U_A1-A1 Switches new/T39
T40: sheet U_A1-A1 Active Bias/T40, sheet U_A1-A1 Switches new/T40
T43: sheet U_A1-A1 Active Bias/T43, sheet U_A1-A1 Switches new/T43
T44: sheet U_A1-A1 Active Bias/T44, sheet U_A1-A1 Switches new/T44
T49: sheet U_A1-A1 Active Bias/T49, sheet U_A1-A1 Switches new/T49
T50: sheet U_A1-A1 Active Bias/T50, sheet U_A1-A1 Switches new/T50
T53: sheet U_A1-A1 Active Bias/T53, sheet U_A1-A1 Switches new/T53
T54: sheet U_A1-A1 Active Bias/T54, sheet U_A1-A1 Switches new/T54
T55: sheet U_A1-A1 Active Bias/T55, sheet U_A1-A1 Switches new/T55
T70: sheet U_A1-A1 Active Bias/T70, sheet U_A1-A1 Switches new/T70
T71: sheet U_A1-A1 Active Bias/T71, sheet U_A1-A1 Switches new/T71
T72: sheet U_A1-A1 Active Bias/T72, sheet U_A1-A1 Switches new/T72
T77: sheet U_A1-A1 Active Bias/T77, sheet U_A1-A1 Switches new/T77
T78: sheet U_A1-A1 Active Bias/T78, sheet U_A1-A1 Switches new/T78
T79: sheet U_A1-A1 Active Bias/T79, sheet U_A1-A1 Switches new/T79
T84: sheet U_A1-A1 Active Bias/T84, sheet U_A1-A1 Switches new/T84
T89: sheet U_A1-A2 Switches new/T89, sheet U_A3 to A1 board Connector b/T89
UPPER_LO: sheet U_A1-A1 Switches Control Logic/UPPER_LO, sheet U_A1-A1 Switches new/UPPER_LO
VCO_OUT: sheet U_Fast PLL Page 2/VCO_OUT, sheet U_Fast PLL/VCO_OUT
NetA1_T47: sheet U_A1-A1 Gain control driver/A1-A1_VVA_series, sheet U_A1-A1 Switches new/A1-A1_VVA_series
NetA1_T48: sheet U_A1-A1 Gain control driver/A1-A1_VVA_shunt, sheet U_A1-A1 Switches new/A1-A1_VVA_shunt
NetA1_T51: sheet U_A1-A2 Switches new/T51, sheet U_A1-A1 Switches new/T51
NetA1_T52: sheet U_A1-A2 Switches new/T52, sheet U_A1-A1 Switches new/T52
NetA1_T100: sheet U_A1-A2 Switches new/T100, sheet U_A1-A2 Power/T100
NetA1_T101: sheet U_A1-A2 Switches new/T101_102, sheet U_A1-A2 Power/T101_102
NetA1_T103: sheet U_A1-A2 Switches new/T103, sheet U_A1-A2 Power/T103
NetAT58_3: sheet U_200MHz_Comb_Gen_Driver/200_MHz_Comb, sheet U_STALO_1/200_MHz_Comb
NetAT65_1: sheet U_STALO_2/STALO_p2-p3, sheet U_STALO_3/STALO_p2-p3
NetC449_1: sheet U_Fast PLL Page 2/PLL_A, sheet U_A3 to A1 board Connector b/PLL_A
NetC450_1: sheet U_Fast PLL Page 2/PLL_C, sheet U_A3 to A1 board Connector b/PLL_C
NetC451_1: sheet U_Fast PLL Page 2/PLL_E, sheet U_A3 to A1 board Connector b/PLL_E
NetC452_1: sheet U_Fast PLL Page 2/PLL_D, sheet U_A3 to A1 board Connector b/PLL_D
NetC453_1: sheet U_Fast PLL Page 2/PLL_B, sheet U_A3 to A1 board Connector b/PLL_B
NetC454_1: sheet U_Fast PLL Page 2/PLL_F, sheet U_A3 to A1 board Connector b/PLL_F
NetC522_2: sheet U_1/1.2_GHz_Comb, sheet U_Ref Mult/1.2_GHz_Comb
NetC979_2: sheet U_A3 to A1 board Connector b/Stalo_Internal/_Ext, sheet U_STALO_3/Stalo_Internal/_Ext
NetFL167_1: sheet U_Fast PLL/A1_PLL_DAC_7, sheet U_A3 to A1 board Connector b/A1_PLL_DAC_7
NetFL182_1: sheet U_Fast PLL/A1_PLL_DAC_6, sheet U_A3 to A1 board Connector b/A1_PLL_DAC_6
NetFL191_1: sheet U_Fast PLL/A1_PLL_DAC_4, sheet U_A3 to A1 board Connector b/A1_PLL_DAC_4
NetFL192_1: sheet U_Fast PLL/A1_PLL_DAC_3, sheet U_A3 to A1 board Connector b/A1_PLL_DAC_3
NetFL197_1: sheet U_Fast PLL/A1_PLL_DAC_0, sheet U_A3 to A1 board Connector b/A1_PLL_DAC_0
NetFL202_1: sheet U_Fast PLL Page 2/PLL_F_-3.3, sheet U_Fast PLL/PLL_F_-3.3
NetFL203_1: sheet U_Fast PLL Page 2/PLL_E_-3.3, sheet U_Fast PLL/PLL_E_-3.3
NetFL204_1: sheet U_Fast PLL Page 2/PLL_D_-3.3, sheet U_Fast PLL/PLL_D_-3.3
NetFL205_1: sheet U_Fast PLL Page 2/PLL_C_-3.3, sheet U_Fast PLL/PLL_C_-3.3
NetFL206_1: sheet U_Fast PLL Page 2/PLL_B_-3.3, sheet U_Fast PLL/PLL_B_-3.3
NetFL207_1: sheet U_Fast PLL Page 2/PLL_A_-3.3, sheet U_Fast PLL/PLL_A_-3.3
NetFL208_1: sheet U_Fast PLL/A1_PLL_DAC_1, sheet U_A3 to A1 board Connector b/A1_PLL_DAC_1
NetFL209_1: sheet U_Fast PLL/A1_PLL_DAC_2, sheet U_A3 to A1 board Connector b/A1_PLL_DAC_2
NetFL228_3: sheet U_A3 to A1 board Connector b/EXT_3.6GHz, sheet U_Modulation/EXT_3.6GHz
NetFL246_1: sheet U_Fast PLL/1200MHz_PLL, sheet U_Ref Mult/1200MHz_PLL
NetFL295_1: sheet U_Fast PLL/A1_PLL_DAC_5, sheet U_A3 to A1 board Connector b/A1_PLL_DAC_5
NetJ6_3: sheet U_Analog Mux/A1-A3_FILTER_C, sheet U_A3 to A1 board Connector b/A1-A3_FILTER_C
NetJ6_5: sheet U_Analog Mux/A1-A3_FILTER_B, sheet U_A3 to A1 board Connector b/A1-A3_FILTER_B
NetJ6_7: sheet U_Analog Mux/A1-A3_FILTER_A, sheet U_A3 to A1 board Connector b/A1-A3_FILTER_A
NetJ6_9: sheet U_Analog Mux/A1-A3_EXT_INPUT_CTRL, sheet U_A3 to A1 board Connector b/A1-A3_EXT_INPUT_CTRL
NetJ6_13: sheet U_Analog Mux/A1-A3_PULSE_MOD, sheet U_A3 to A1 board Connector b/A1-A3_PULSE_MOD
NetR507_2: sheet U_A1-A1 Switches Control Logic/100ps, sheet U_A1-A1 Switches new/100ps, sheet U_A3 to A1 board Connector b/100ps
NetR508_2: sheet U_A1-A1 Switches Control Logic/200ps, sheet U_A1-A1 Switches new/200ps, sheet U_A3 to A1 board Connector b/200ps
NetR509_2: sheet U_A1-A1 Switches Control Logic/400ps_1, sheet U_A1-A1 Switches new/400ps_1, sheet U_A3 to A1 board Connector b/400ps_1
NetR527_2: sheet U_A3 to A1 board Connector b/MOD_INVERSION, sheet U_Modulation/MOD_INVERSION
NetR545_2: sheet U_A3 to A1 board Connector b/STALO_FILTER_C, sheet U_STALO_3/STALO_FILTER_C
NetR546_2: sheet U_A3 to A1 board Connector b/STALO_FILTER_B, sheet U_STALO_3/STALO_FILTER_B
NetR547_2: sheet U_A3 to A1 board Connector b/STALO_FILTER_A, sheet U_STALO_3/STALO_FILTER_A
NetR565_2: sheet U_A1-A1 Switches Control Logic/UPPER_LOWER_LO, sheet U_A3 to A1 board Connector b/UPPER_LOWER_LO
NetR567_2: sheet U_A1-A1 Switches Control Logic/INPUT_6P_A, sheet U_A3 to A1 board Connector b/INPUT_6P_A
NetR568_2: sheet U_A1-A1 Switches Control Logic/INPUT_6P_B, sheet U_A3 to A1 board Connector b/INPUT_6P_B
NetR569_2: sheet U_A1-A1 Switches Control Logic/INPUT_6P_C, sheet U_A3 to A1 board Connector b/INPUT_6P_C
NetR571_2: sheet U_A1-A1 Switches Control Logic/UPPER_LOWER_IF, sheet U_A3 to A1 board Connector b/UPPER_LOWER_IF
NetR575_2: sheet U_A1-A1 Switches Control Logic/OUTPUT_6P_A, sheet U_A3 to A1 board Connector b/OUTPUT_6P_A
NetR576_2: sheet U_A1-A1 Switches Control Logic/OUTPUT_6P_B, sheet U_A3 to A1 board Connector b/OUTPUT_6P_B
NetR577_2: sheet U_A1-A1 Switches Control Logic/OUTPUT_6P_C, sheet U_A3 to A1 board Connector b/OUTPUT_6P_C
NetU1_6: sheet U_Ref Mult/2400MHz_Stalo, sheet U_STALO_1/2400MHz_Stalo

Not connected (* = marked no-connect by the designer): FUD1 1; FUD2 1; FUD3 1; FUD4 1; FUD5 1; FUD6 1

### Notes on the sheet
- AND DESIGN RIGHTS BELONGING TO GIGA-TRONICS
- THIS DOCUMENT CONTAINS PROPRIETARY INFORMATION
- EXCEPT CALIBRATION, OPERATION, AND MAINTENANCE
- AND MAY NOT BE REPRODUCED FOR ANY REASON
- WITHOUT WRITTEN AUTHORIZATION.
- 11.9
- 12.1
- (near COAX3) 11.8
- 11.8
- (near MTG50) DRAWN
- REV
- DESCRIPTION
- REVISIONS
- ECO
- DATE
- DRAWN BY
- APPROVED
- APPROVALS
- Title
- Sheet Title
- NOTES UNLESS OTHERWISE SPECIFIED:
  1. CAPACITOR VALUES ARE IN uF
  2. RESISTOR VALUES ARE IN OHMS
- PRINTED DOCUMENT IS CONSIDERED UNCONTROLLED. VERIFY REVISION IN PLM SYSTEM.
- THIS DOCUMENT CONTAINS PROPRIETARY INFORMATION. DESIGN RIGHTS BELONG TO GIGA-TRONICS AND MAY NOT BE REPRODUCED WITHOUT WRITTEN AUTHORIZATION FOR ANY REASON EXCEPT CALIBRATION, OPERATION AND MAINTENANCE.
- CHECKED
- ENG
- MFG ENG
- QA
- Size
- CAGE CODE
- Filename
- D
- Document Number
- 58900
- Date
- Sheet
- Rev
- of
- (in symbol 35117) PCB
- (in symbol 35131) PCB

### Library data of the parts
0 = 35132: PCA, HYDRA A1 UC/LO; NoLoad: .; level: 0; line_number: 0; item_number: 35132
1 = 35131: PCB, HYDRA A1 UC/LO; NoLoad: .; MFGR: STREAMLINE CIRCUITS; Approved: MH; level: 1; M_PN: 35131; ModifyDate: 2016-03-18; line_number: 1; item_number: 35131
2 = 35133: SCH, HYDRA A1 UC/LO; NoLoad: .; level: 1; line_number: 2; item_number: 35133
COAX1 COAX2 COAX6 COAX10 COAX17 COAX19 = Coax Bot-Mid4: level: 1
COAX3-COAX5 COAX8 COAX9 COAX11-COAX13 COAX21 = Coax Top-Mid3: level: 1
COAX14-COAX16 COAX18 COAX20 = Coax Top-Bot: level: 1
FUD1-FUD6 = FIDUCIAL_GLOBAL: level: 1; Value: *
MH2 MH5-MH7 MH9-MH19 = MHP-250X116: level: 1; NoLoad: N/L; ModifyDate: 02/14/2008 14:07:19; Value: *
MTG1-MTG4 MTG6-MTG8 MTG10-MTG31 MTG34 MTG38-MTG44 MTG46-MTG61 MTG67-MTG72 MTG74 MTG76 MTG77 MTG80-MTG85 MTG88 MTG94 MTG95 MTG97-MTG101 = MHP200X92: level: 1; ModifyDate: 02/14/2008 14:07:19; Value: *
MTG102 = QMSS-CLAMP-ASSY: connector retaining clip, KFH-440-12 stud, nut; level: 1; Approved: *; G_PN: *; MFGR: *; Value: *
MTG103#1 = QMSS-CABLE-PROXY (A1): NoLoad: .; RefDes2: {RefDes2}; Approved: *; G_PN: *; MFGR: *; Value: *
MTG104#1 = 35129_A3_PCBA_PROXY: NoLoad: .; RefDes2: {RefDes2}; Approved: *; G_PN: *; MFGR: *; Value: *
MTG110-MTG113 = MHP150X67: MHP200X92; level: 1; ModifyDate: 02/14/2008 14:07:19; Value: *
MTG201 = 380x190MIL_SLOT: level: 1
PCA35117 = 35117: HYDRA A1-A3 BOARD PCA; level: 1